# Altium schematic sheet MCU.SchDoc
size 420 x 297 mm; SheetNumber: 2; SheetTotal: 11
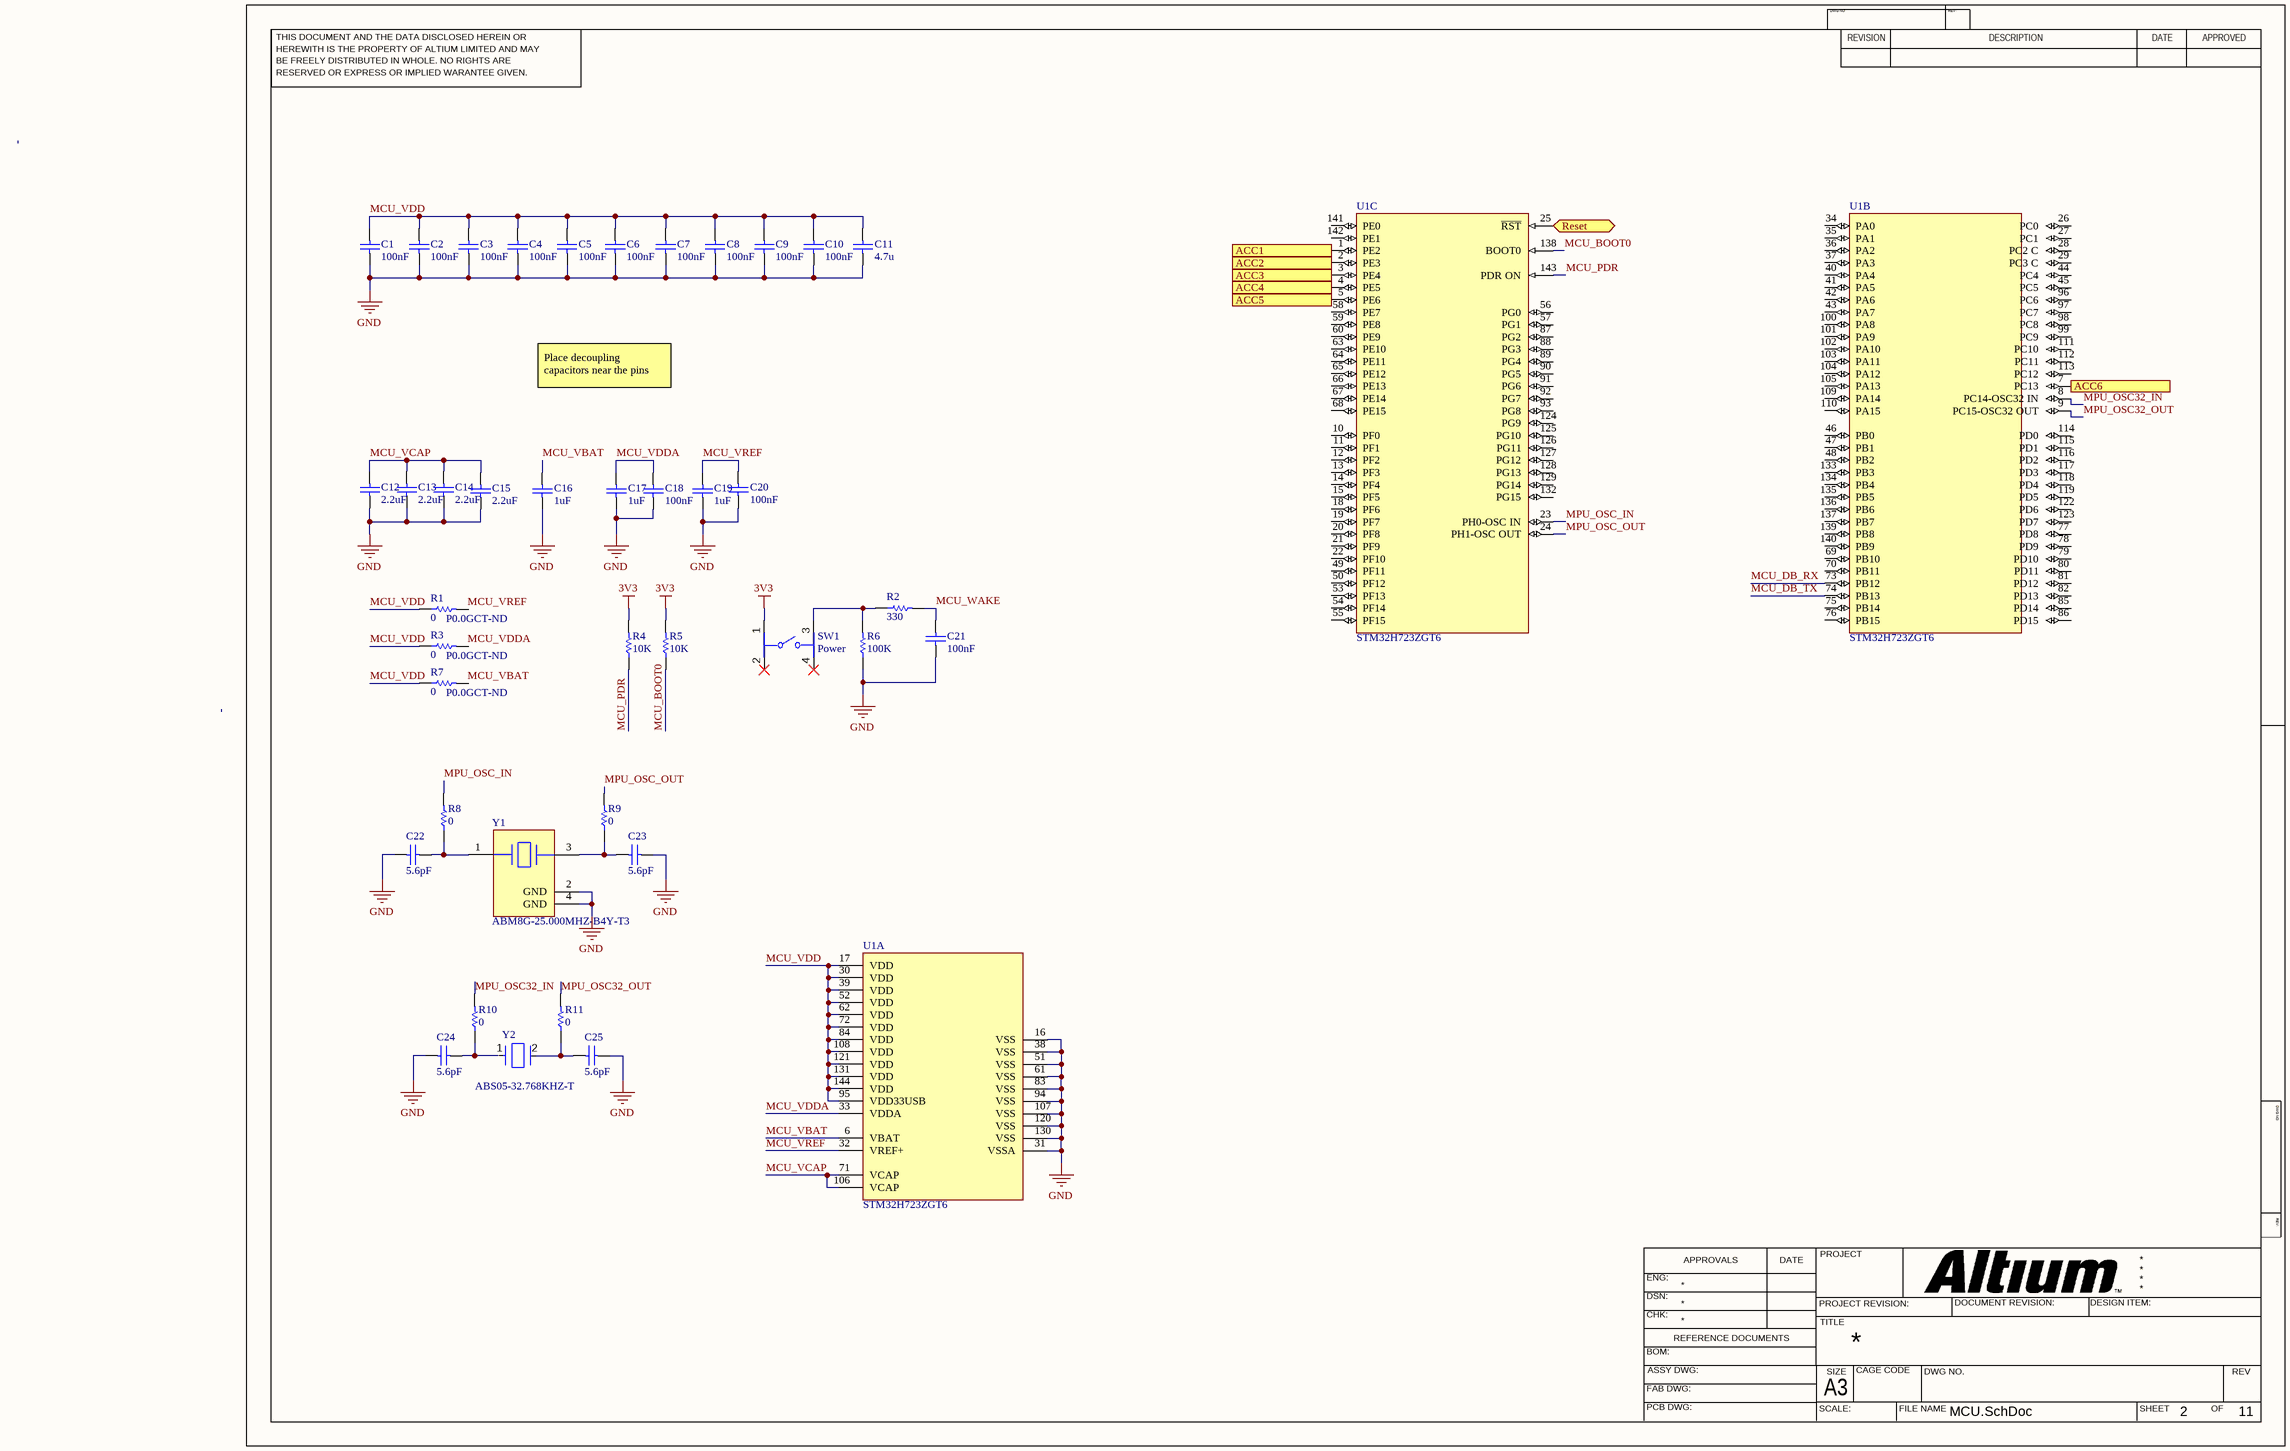
[diagram p0: MCU.SchDoc]

## Parts
C1  value 100nF  (hidden comment: Capacitor)
C2  value 100nF  (hidden comment: Capacitor)
C3  value 100nF  (hidden comment: Capacitor)
C4  value 100nF  (hidden comment: Capacitor)
C5  value 100nF  (hidden comment: Capacitor)
C6  value 100nF  (hidden comment: Capacitor)
C7  value 100nF  (hidden comment: Capacitor)
C8  value 100nF  (hidden comment: Capacitor)
C9  value 100nF  (hidden comment: Capacitor)
C10  value 100nF  (hidden comment: Capacitor)
C11  value 4.7u  (hidden comment: Capacitor)
C12  value 2.2uF  (hidden comment: Capacitor)
C13  value 2.2uF  (hidden comment: Capacitor)
C14  value 2.2uF  (hidden comment: Capacitor)
C15  value 2.2uF  (hidden comment: Capacitor)
C16  value 1uF  (hidden comment: Capacitor)
C17  value 1uF  (hidden comment: Capacitor)
C18  value 100nF  (hidden comment: Capacitor)
C19  value 1uF  (hidden comment: Capacitor)
C20  value 100nF  (hidden comment: Capacitor)
C21  value 100nF  (hidden comment: Capacitor)
C22  value 5.6pF  (hidden comment: Capacitor)
C23  value 5.6pF  (hidden comment: Capacitor)
C24  value 5.6pF  (hidden comment: Capacitor)
C25  value 5.6pF  (hidden comment: Capacitor)
R1  value 0  Supplier Part Number 1: P0.0GCT-ND  (hidden comment: Resistor)
R2  value 330  (hidden comment: Resistor)
R3  value 0  Supplier Part Number 1: P0.0GCT-ND  (hidden comment: Resistor)
R4  value 10K  (hidden comment: Resistor)
R5  value 10K  (hidden comment: Resistor)
R6  value 100K  (hidden comment: Resistor)
R7  value 0  Supplier Part Number 1: P0.0GCT-ND  (hidden comment: Resistor)
R8  value 0  (hidden comment: Resistor)
R9  value 0  (hidden comment: Resistor)
R10  value 0  (hidden comment: Resistor)
R11  value 0  (hidden comment: Resistor)
SW1  Power  [FP-PTS526SK15SMTR2LFS-MFG]
U1  STM32H723ZGT6  [FP-LQFP144-1A-IPC_A]  (parts A,B,C of 3)
Y1  ABM8G-25.000MHZ-B4Y-T3  [FP-ABM8G-MFG]
Y2  ABS05-32.768KHZ-T  [FP-ABS05-MFG]

## Ports
ACC1 (out), ACC2 (out), ACC3 (out), ACC4 (out), ACC5 (out), ACC6 (out), Reset (bidir)

## Nets
3V3: R4.2 R5.2 SW1.1
GND: C1.1 C2.1 C3.1 C4.1 C5.1 C6.1 C7.1 C8.1 C9.1 C10.1 C11.1 C12.1 C13.1 C14.1 C15.1 C16.1 C17.1 C18.1 C19.1 C20.1 C21.1 C22.2 C23.1 C24.2 C25.1 R6.1 U1.16(VSS) U1.31(VSSA) U1.38(VSS) U1.51(VSS) U1.61(VSS) U1.83(VSS) U1.94(VSS) U1.107(VSS) U1.120(VSS) U1.130(VSS) Y1.2(GND) Y1.4(GND)
ACC1: U1.1(PE2) ; port ACC1
ACC2: U1.2(PE3) ; port ACC2
ACC3: U1.3(PE4) ; port ACC3
ACC4: U1.4(PE5) ; port ACC4
ACC5: U1.5(PE6) ; port ACC5
ACC6: U1.7(PC13) ; port ACC6
MCU_BOOT0: R5.1 U1.138(BOOT0)
MCU_DB_RX: U1.73(PB12)
MCU_DB_TX: U1.74(PB13)
MCU_PDR: R4.1 U1.143(PDR_ON)
MCU_VBAT: C16.2 U1.6(VBAT)
MCU_VCAP: C12.2 C13.2 C14.2 C15.2 U1.71(VCAP) U1.106(VCAP)
MCU_VDD: C1.2 C2.2 C3.2 C4.2 C5.2 C6.2 C7.2 C8.2 C9.2 C10.2 C11.2 R1.1 R3.1 R7.1 U1.17(VDD) U1.30(VDD) U1.39(VDD) U1.52(VDD) U1.62(VDD) U1.72(VDD) U1.84(VDD) U1.95(VDD33USB) U1.108(VDD) U1.121(VDD) U1.131(VDD) U1.144(VDD)
MCU_VDDA: C17.2 C18.2 U1.33(VDDA)
MCU_VREF: C19.2 C20.2 U1.32(VREF+)
MCU_WAKE: C21.2 R2.2
MPU_OSC32_IN: R10.2 U1.8(PC14-OSC32_IN)
MPU_OSC32_OUT: R11.2 U1.9(PC15-OSC32_OUT)
MPU_OSC_IN: R8.2 U1.23(PH0-OSC_IN)
MPU_OSC_OUT: R9.2 U1.24(PH1-OSC_OUT)
Reset: U1.25(~{RST}) ; port Reset
NetC22_1: C22.1 R8.1 Y1.1
NetC23_2: C23.2 R9.1 Y1.3
NetC24_1: C24.1 R10.1
NetC25_2: C25.2 R11.1 Y2.2
NetR2_1: R2.1 R6.2 SW1.3

Not connected (* = marked no-connect by the designer): R1 2; R3 2; R7 2; SW1 2* 4*; U1 10(PF0) 11(PF1) 12(PF2) 13(PF3) 14(PF4) 15(PF5) 18(PF6) 19(PF7) 20(PF8) 21(PF9) 22(PF10) 26(PC0) 27(PC1) 28(PC2_C) 29(PC3_C) 34(PA0) 35(PA1) 36(PA2) 37(PA3) 40(PA4) 41(PA5) 42(PA6) 43(PA7) 44(PC4) 45(PC5) 46(PB0) 47(PB1) 48(PB2) 49(PF11) 50(PF12) 53(PF13) 54(PF14) 55(PF15) 56(PG0) 57(PG1) 58(PE7) 59(PE8) 60(PE9) 63(PE10) 64(PE11) 65(PE12) 66(PE13) 67(PE14) 68(PE15) 69(PB10) 70(PB11) 75(PB14) 76(PB15) 77(PD8) 78(PD9) 79(PD10) 80(PD11) 81(PD12) 82(PD13) 85(PD14) 86(PD15) 87(PG2) 88(PG3) 89(PG4) 90(PG5) 91(PG6) 92(PG7) 93(PG8) 96(PC6) 97(PC7) 98(PC8) 99(PC9) 100(PA8) 101(PA9) 102(PA10) 103(PA11) 104(PA12) 105(PA13) 109(PA14) 110(PA15) 111(PC10) 112(PC11) 113(PC12) 114(PD0) 115(PD1) 116(PD2) 117(PD3) 118(PD4) 119(PD5) 122(PD6) 123(PD7) 124(PG9) 125(PG10) 126(PG11) 127(PG12) 128(PG13) 129(PG14) 132(PG15) 133(PB3) 134(PB4) 135(PB5) 136(PB6) 137(PB7) 139(PB8) 140(PB9) 141(PE0) 142(PE1); Y2 1

## Notes on the sheet
- Place decoupling capacitors near the pins
- Labels drawn without touching a wire or pin: MCU_VBAT, MCU_VDDA, MCU_VREF
- THIS DOCUMENT AND THE DATA DISCLOSED HEREIN OR
- HEREWITH IS THE PROPERTY OF ALTIUM LIMITED AND MAY
- DWG NO:
- REVISION
- REV:
- DESCRIPTION
- DATE
- APPROVED
- BE FREELY DISTRIBUTED IN WHOLE. NO RIGHTS ARE
- RESERVED OR EXPRESS OR IMPLIED WARANTEE GIVEN.
- ENG:
- APPROVALS
- PROJECT
- DSN:
- CHK:
- REFERENCE DOCUMENTS
- PROJECT REVISION:
- TITLE
- DOCUMENT REVISION:
- DESIGN ITEM:
- BOM:
- FAB DWG:
- PCB DWG:
- ASSY DWG:
- SCALE:
- A3
- SIZE
- CAGE CODE
- FILE NAME
- DWG NO.
- SHEET
- OF
- REV

## Library data of the parts
C1-C25 = Capacitor: SimulationGenericComponent: True
  C1-C10 C18 C20 C21: Supplier 1: Arrow Electronics
R1 R3 R7-R11 = Resistor: SimulationGenericComponent: True; TC1: 0; TC2: 0; Supplier 1: Digi-Key
  R8-R11: Supplier Part Number 1: P0.0GCT-ND
R2 R4-R6 = Resistor: TC1: 0; SimulationGenericComponent: True; TC2: 0
SW1 = CMP-10040-000013-1: TACT 5.2 X 5.2, 1.5 MM H, 260GF,; Manufacturer: C&K; Manufacturer Part Number: PTS526SK15SMTR2LFS; Operating Force: 250gf; Throw Configuration: SPST-NO; Contact Current Rating: 50mA; Standoff Height: 0mm; Contact Resistance: 100mΩ; Voltage Rating Dc: 12V; Electromechanical Life: 200000Cycles; Device Class L3: Tactile Switches; Device Class L2: Switches; Temperature: -20°C to +70°C; Temperature Range Low: -20°C; Package: PTS526SK15SMTR2LFS; Temperature Range High: +70°C; ComponentLink2Description: Datasheet; Device Class L1: Electromechanical; Height: 1.65mm; Digikey Description: TACT 5.2 X 5.2, 1.5 MM H, 260GF,; Category: Switch; RoHS: TRUE; Automotive: No; Lead Free: Yes; Octopart: https://octopart.com/pts526+sk15+smtr2+lfs-c%26k+components-100617999; ComponentLink2URL: https://www.ckswitches.com/media/2780/pts526.pdf
U1 = CMP-12105-000148-1: IC MCU 32BIT 1MB FLASH 144LQFP
Y1 = CMP-27762-015306-1: Crystal 25MHz ±30ppm (Tol) ±30ppm (Stability) 10pF FUND 60Ω 4-Pin SMD T/R; ESR (Equivalent Series Resistance): 60R; Max Operating Temperature: 70°C; Packaging: Tape and Reel; Length: 0.126inch; Height: 0.039inch; Frequency Stability: 30ppm; Package Quantity: 3000; Width: 2.5mm; Number of Pins: 4; Case/Package: SMD/SMT; Mount: Surface Mount; Series: ABM8G; Load Capacitance: 10pF; Min Operating Temperature: -20°C; Termination: SMD/SMT; Frequency: 25MHz; Tolerance: 30ppm; Frequency Tolerance: 30ppm
Y2 = CMP-27762-008890-2: Crystal 32.768kHz ±20ppm (Tol) 12.5pF FUND 90kΩ 2-Pin SMD T/R; Series Resistance: 90kR; Length: 1.6mm; Package Quantity: 3000; Packaging: Tape and Reel; Max Operating Temperature: 85°C; Lead Free: Lead Free; Tolerance: 20ppm; Frequency: 32.768kHz; Termination: SMD/SMT; REACH SVHC: No SVHC; Width: 1mm; Min Operating Temperature: -40°C; RoHS Compliant: Yes; Case/Package: CSMD; ESR (Equivalent Series Resistance): 90kR; Number of Pins: 2; Height: 0.5mm; Series: ABS05; Load Capacitance: 12.5pF; Frequency Tolerance: 20ppm; Depth: 1mm; Operating Frequency: 32.768 kHz; Mount: Surface Mount; Radiation Hardening: No